# EAGLE design power_supply (EAGLE 9.6.1)
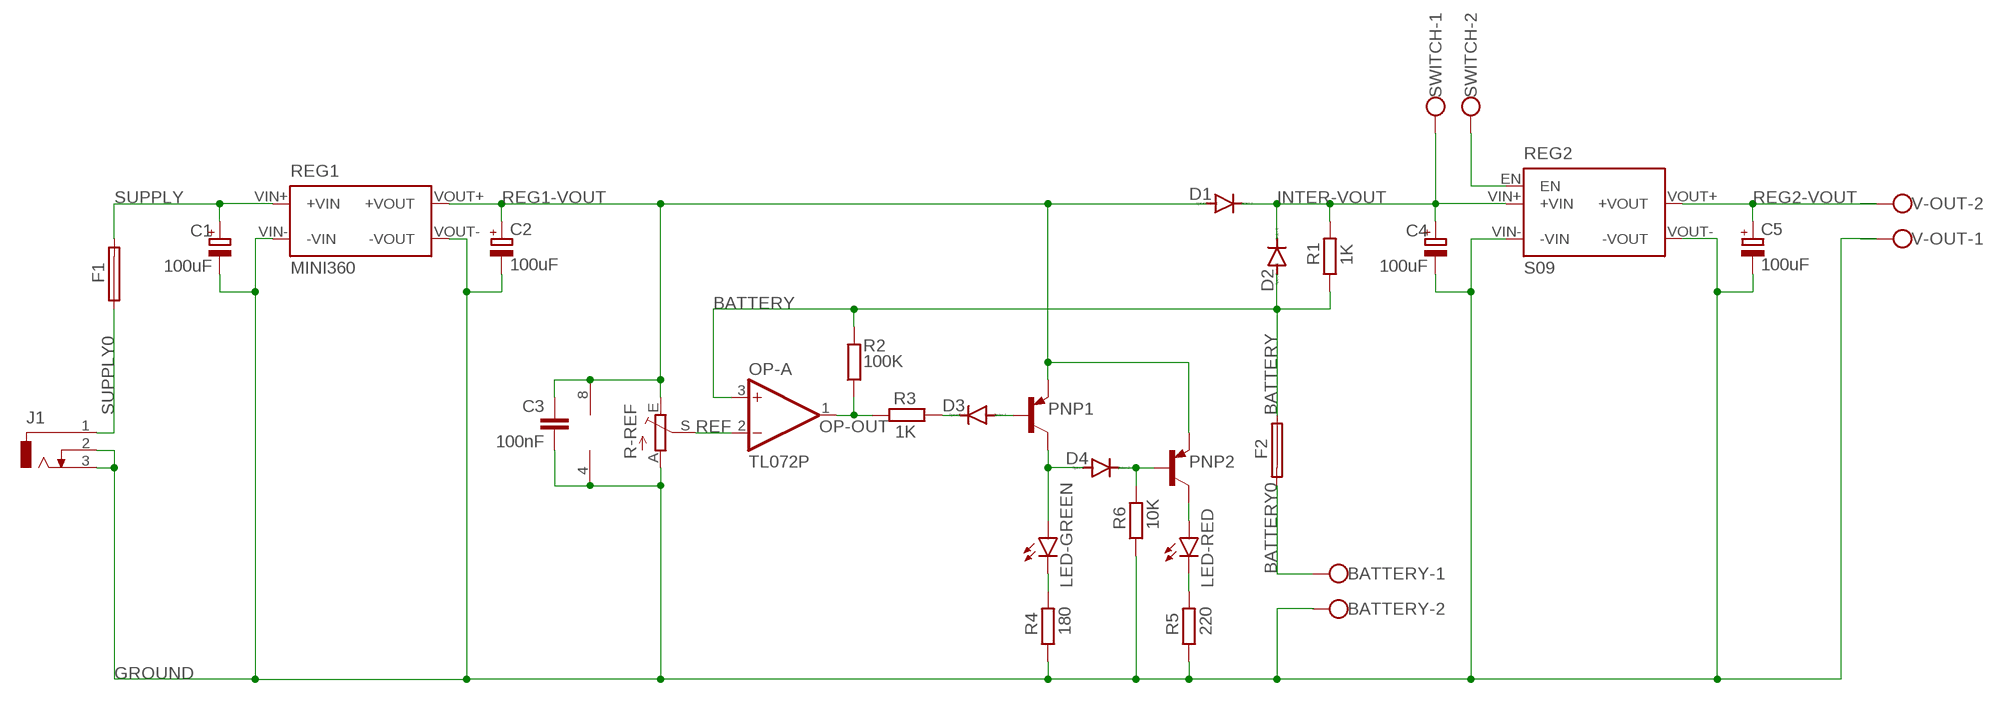
[diagram p0: schematic, sheet 1]

## Parts
BATTERY  W237-102  [W237-102]
C1  100uF  CPOL-EUE5-6  [E5-6]
C2  100uF  CPOL-EUE5-6  [E5-6]
C3  100nF  C5/2.5  [C5B2.5]
C4  100uF  CPOL-EUE2-5  [E2-5]
C5  100uF  CPOL-EUE2-5  [E2-5]
D1  BAS15  [DO34-7]
D2  BAS15  [DO34-7]
D3  BAS15  [DO34-7]
D4  BAS15  [DO34-7]
F1  SH22,5  [SH22,5]
F2  SH22,5  [SH22,5]
J1  DCJ0303  [DCJ0303]
LED-GREEN  LED5MM  [LED5MM]
LED-RED  LED5MM  [LED5MM]
OP-  TL072P  [DIL08]
PNP1  BC557A-PNP-TO92-EBC  [TO92-EBC]
PNP2  BC557A-PNP-TO92-EBC  [TO92-EBC]
R1  1K  R-EU_0204/7  [0204/7]
R2  100K  R-EU_0204/7  [0204/7]
R3  1K  R-EU_0204/7  [0204/7]
R4  180  R-EU_0204/7  [0204/7]
R5  220  R-EU_0204/7  [0204/7]
R6  10K  R-EU_0204/7  [0204/7]
R-REF  TRIM_EU-PT10  [PT-10]
REG1  MINI360  [DC-DC-CONVERTER-MINI360]
REG2  S09  [DC-DC-CONVERTER-S09]
SWITCH  W237-102  [W237-102]
V-OUT  W237-102  [W237-102]

## Nets
BATTERY: D2.A F2.1 OP-.3(A:+IN) R1.1 R2.2
BATTERY0: BATTERY.1 F2.2
ENABLE: REG2.EN SWITCH.2
GROUND: BATTERY.2 C1.- C2.- C3.2 C4.- C5.- J1.2 J1.3 OP-.4(P:V-) R4.1 R5.1 R6.1 R-REF.A REG1.VIN-(-VIN) REG1.VOUT-(-VOUT) REG2.VIN-(-VIN) REG2.VOUT-(-VOUT) V-OUT.1
INTER-VOUT: C4.+ D1.C D2.C R1.2 REG2.VIN+(+VIN) SWITCH.1
N$20: LED-RED.A PNP2.C
N$174: D3.C R3.1
N$175: D3.A PNP1.B
N$176: D4.A LED-GREEN.A PNP1.C
N$177: D4.C PNP2.B R6.2
N$179: LED-RED.K(C) R5.2
N$180: LED-GREEN.K(C) R4.2
OP-OUT: OP-.1(A:OUT) R2.1 R3.2
REF: OP-.2(A:-IN) R-REF.S
REG1-VOUT: C2.+ C3.1 D1.A OP-.8(P:V+) PNP1.E PNP2.E R-REF.E REG1.VOUT+(+VOUT)
REG2-VOUT: C5.+ REG2.VOUT+(+VOUT) V-OUT.2
SUPPLY: C1.+ F1.2 REG1.VIN+(+VIN)
SUPPLY0: F1.1 J1.1
Unconnected: OP-.5(B:+IN) OP-.6(B:-IN) OP-.7(B:OUT)

## Library data of the parts
BATTERY SWITCH V-OUT = con-wago-500:W237-102: WAGO SCREW CLAMP; MPN: 237-102; OC_FARNELL: unknown; OC_NEWARK: 70K9898
C1 C2 C4 C5 = rcl:CPOL-EU: POLARIZED CAPACITOR, European symbol; SPICEPREFIX: C
C3 = capacitor-wima:C: CAPACITOR naming: grid - package width
D1-D4 = diode:BAS15: DIODE high speed
F1 F2 = fuse:SH22,5: FUSE HOLDER grid 22,5 mm, OGN0031 8201, Schurter (Buerklin); MF: SCHURTER; MPN: 0031.8201; OC_FARNELL: 1162740; OC_NEWARK: 96F8317
J1 = con-jack:DCJ0303: DC POWER JACK Source: DCJ0303.pdf; OC_FARNELL: unknown; OC_NEWARK: unknown
LED-GREEN LED-RED = led:LED: LED OSRAM: - CHIPLED LG R971, LG N971, LY N971, LG Q971, LY Q971, LO R971, LY R971 LH N974, LH R974 LS Q976, LO Q976, LY Q976 LO Q996 - Hyper CHIPLED LW Q18S LB Q993, LB Q99A, LB R99A - SideLED LS A670, LO A670, LY A670, LG A670, LP A670 LB A673, LV A673, LT A673, LW A673 LH A674 LY A675 LS A676, LA A676, LO A676, LY A676, LW A676 LS A679, LY A679, LG A679 - Hyper Micro SIDELED® LS Y876, LA Y876, LO Y876, LY Y876 LT Y87S - SmartLED LW L88C, LW L88S LB L89C, LB L89S, LG L890 LS L89K, LO L89K, LY L89K LS L896, LA L896, LO L896, LY L896 - TOPLED LS T670, LO T670, LY T670, LG T670, LP T670 LSG T670, LSP T670, LSY T670, LOP T670, LYG T670 LG T671, LOG T671, LSG T671 LB T673, LV T673, LT T673, LW T673 LH T674 LS T676, LA T676, LO T676, LY T676, LB T676, LH T676, LSB T676, LW T676 LB T67C, LV T67C, LT T67C, LS T67K, LO T67K, LY T67K, LW E67C LS E67B, LA E67B, LO E67B, LY E67B, LB E67C, LV E67C, LT E67C LW T67C LS T679, LY T679, LG T679 LS T770, LO T770, LY T770, LG T770, LP T770 LB T773, LV T773, LT T773, LW T773 LH T774 LS E675, LA E675, LY E675, LS T675 LS T776, LA T776, LO T776, LY T776, LB T776 LHGB T686 LT T68C, LB T68C - Hyper Mini TOPLED® LB M676 - Mini TOPLED Santana® LG M470 LS M47K, LO M47K, LY M47K Source: http://www.osram.convergy.de LUXEON: - LUMILED® LXK2-PW12-R00, LXK2-PW12-S00, LXK2-PW14-U00, LXK2-PW14-V00 LXK2-PM12-R00, LXK2-PM12-S00, LXK2-PM14-U00 LXK2-PE12-Q00, LXK2-PE12-R00, LXK2-PE12-S00, LXK2-PE14-T00, LXK2-PE14-U00 LXK2-PB12-K00, LXK2-PB12-L00, LXK2-PB12-M00, LXK2-PB14-N00, LXK2-PB14-P00, LXK2-PB14-Q00 LXK2-PR12-L00, LXK2-PR12-M00, LXK2-PR14-Q00, LXK2-PR14-R00 LXK2-PD12-Q00, LXK2-PD12-R00, LXK2-PD12-S00 LXK2-PH12-R00, LXK2-PH12-S00 LXK2-PL12-P00, LXK2-PL12-Q00, LXK2-PL12-R00 Source: www.luxeon.com KINGBRIGHT: KA-3528ASYC Source: www.kingbright.com
OP- = linear:TL072: OP AMP
PNP1 PNP2 = transistor:*-PNP-: PNP Transistror
R1-R6 = rcl:R-EU_: RESISTOR, European symbol; SPICEPREFIX: R
R-REF = pot:TRIM_EU-: POTENTIOMETER
REG1 = mini360:MINI360
REG2 = s09:S09

## Board
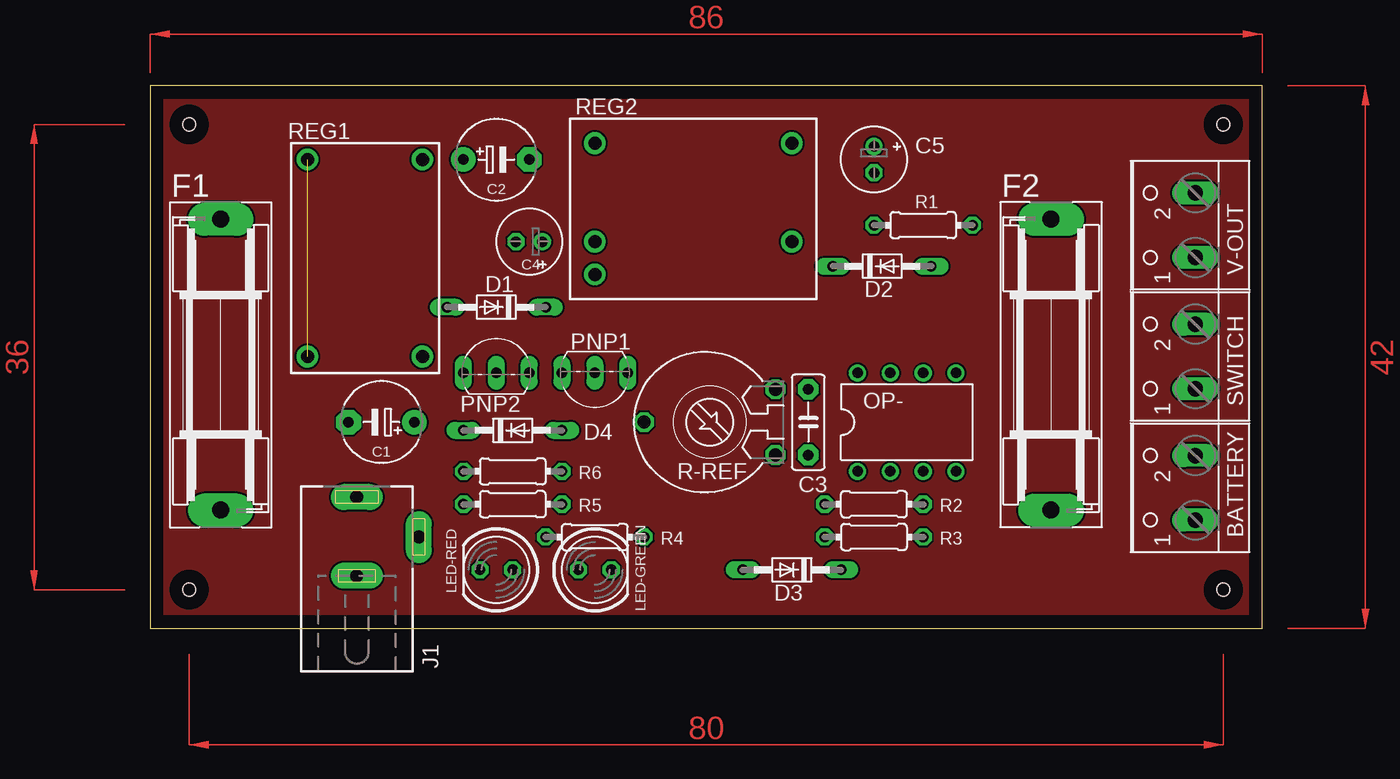
[diagram p1: board, top side]
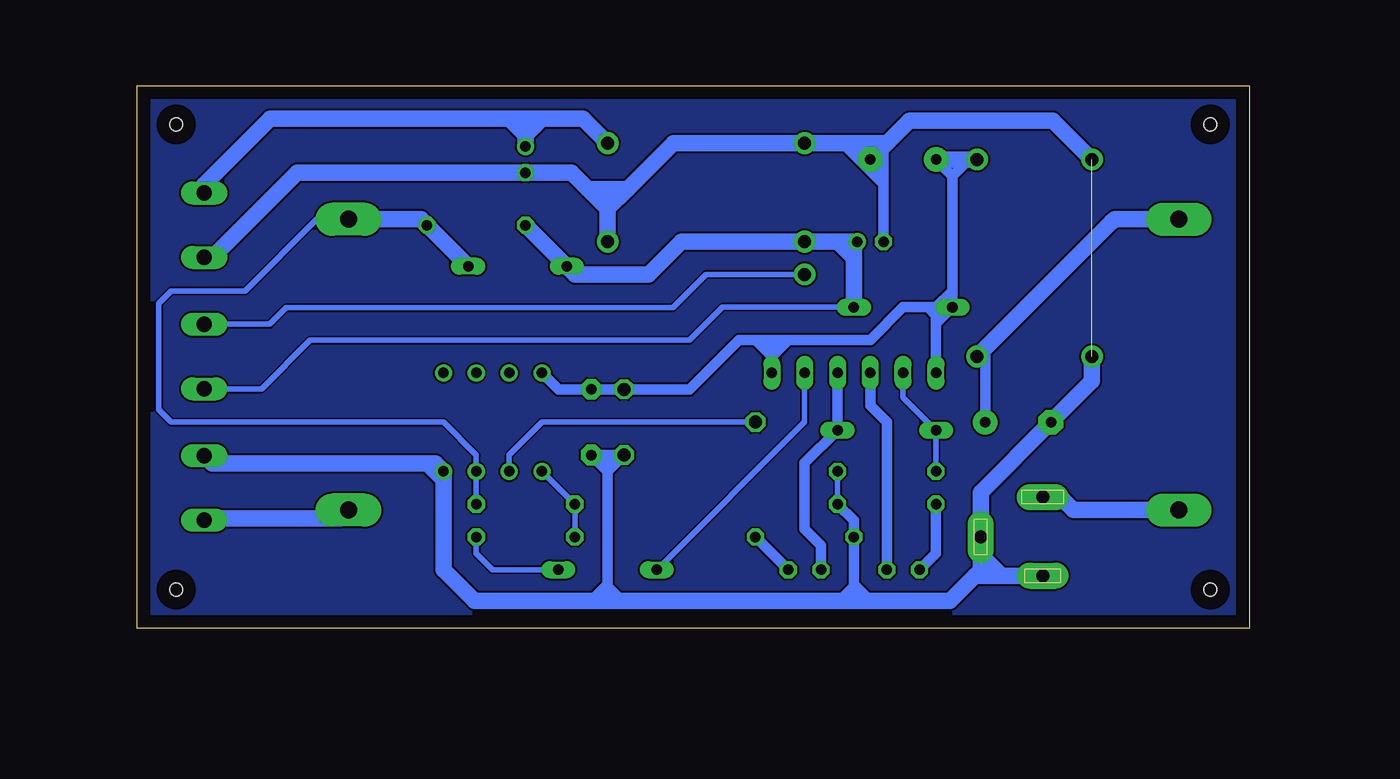
[diagram p2: board, bottom side, seen from below]

Size 86 x 42 mm. Coordinates in mm from the lower left corner, seen from the top.
Outline: 0,0 86,0 86,42 0,42 0,0
Copper layers (1*16): Top 0.035mm / dielectric 0.15mm / Bottom 0.035mm
Design rules "default": minimum track width 6mil, minimum drill 0.35mm, track to track 6mil, track to pad 6mil, pad to pad 6mil, via to via 6mil, smd to smd 6mil, copper to edge 40mil, drill to drill 6mil, minimum pad ring 10mil, minimum via ring 8mil, stop-mask expansion 4mil, vias tented up to drill 0mil, thermal gap 10mil
Holes 1 mm at 3,39 3,3 83,39 83,3

### Footprints (pad centres in the part's own frame; a part is rotated, then mirrored left to right if it is on the bottom)
W237-102 = drill 1.194 long: 1 -2.5,-1.27; 2 2.5,-1.27
E5-6 = drill 0.813 pad 1.905: + -2.54,0 | drill 0.813 pad 1.905 octagon: - 2.54,0
C5B2.5 = drill 0.813 pad 1.6 octagon: 1 -2.54,0; 2 2.54,0
E2-5 = drill 0.813 pad 1.27: + -1.016,0 | drill 0.813 pad 1.27 octagon: - 1.016,0
DO34-7 = drill 0.813 long: A 3.81,0; C -3.81,0
SH22,5 = drill 1.321 pad 2.54 long: 1 -11.252,0; 2 11.252,0
DCJ0303 = drill 1 pad 2 long: 1 0,3.1; 2 4.8,0; 3 0,-3
LED5MM = drill 0.813 octagon: A -1.27,0; K 1.27,0
DIL08 = drill 0.813 pad 1.27: 1 -3.81,-3.81; 2 -1.27,-3.81; 3 1.27,-3.81; 4 3.81,-3.81; 5 3.81,3.81; 6 1.27,3.81; 7 -1.27,3.81; 8 -3.81,3.81
TO92-EBC = drill 0.813 long: B 0,-1.27; C 2.54,-1.27; E -2.54,-1.27
0204/7 = drill 0.813 octagon: 1 -3.81,0; 2 3.81,0
PT-10 = drill 1.016 octagon: A -2.54,-5.08; E 2.54,-5.08; S 0,5.08
DC-DC-CONVERTER-MINI360 = drill 1 pad 1.676: VIN+ -7.62,-5.08; VIN- -7.62,3.81; VOUT+ 7.62,-5.08; VOUT- 7.62,3.81
DC-DC-CONVERTER-S09 = drill 1 pad 1.676: EN -7.62,-5.08; VIN+ -7.62,-2.54; VIN- -7.62,5.08; VOUT+ 7.62,5.08; VOUT- 7.62,-2.54

### Placement (x,y rotation side)
BATTERY  79.56,10.89 90 top
C1  17.88,15.96 180 top
C2  26.77,36.28 0 top
C3  50.9,15.96 270 top
C4  29.3,29.94 180 top
C5  55.98,36.28 270 top
D1  26.77,24.86 180 top
D2  56.61,28.03 0 top
D3  49.62,4.53 180 top
D4  28.04,15.33 0 top
F1  5.45,20.41 90 top
F2  69.67,20.41 270 top
J1  15.97,7.08 0 top
LED-GREEN  34.38,4.53 0 top
LED-RED  26.77,4.53 180 top
OP-  58.52,15.96 0 top
PNP1  34.38,18.5 180 top
PNP2  26.77,21.05 0 top
R1  59.78,31.2 180 top
R2  55.98,9.62 0 top
R3  55.98,7.08 180 top
R4  34.38,7.08 0 top
R5  28.04,9.62 180 top
R6  28.04,12.16 180 top
R-REF  43.27,15.96 90 top
REG1  15.97,28.66 90 top
REG2  42.01,32.48 0 top
SWITCH  79.56,21.05 90 top
V-OUT  79.56,31.2 90 top

### Tracks (layer width: path | path; a pad name or v marks a point on that pad's centre or on a via)
BATTERY
  Bottom 0.406: R2.2 OP-.3 59.78,13.43 62.33,15.96 83.38,15.96 84.37,16.96 84.37,25.13 83.38,26.12 77.66,26.12 72.12,31.66 F2.1
  Bottom 1.27: F2.1 64.05,31.66 R1.1 D2.A
BATTERY0
  Bottom 1.27: F2.2 70.31,8.52 80.7,8.52 BATTERY.1
ENABLE
  Bottom 0.406: REG2.EN 42.01,27.39 44.59,24.82 74.48,24.82 75.75,23.55 SWITCH.2
GROUND  (1 unrouted)
  Bottom 0.406: R6.1 R5.1 | R4.1 30.57,8.34
  Bottom 0.813: R5.1 30.57,8.34 30.57,3.27 | 30.57,3.27 30.57,1.99 | BATTERY.2 80.88,13.39 80.83,13.43 | 49.62,12.16 R-REF.A 49.53,13.43 | 49.62,12.16 49.62,11.52 | 49.62,11.52 49.62,8.98 49.62,3.27 | 49.62,1.99 49.62,3.27 | 29.3,2.15 30.42,3.27 30.57,3.27 | 30.57,3.27 31.69,2.15 31.84,2.15 | 49.62,3.27 48.51,2.15 47.72,2.15 | 49.62,3.27 49.78,3.27 50.9,2.15 | 49.62,12.16 C3.2 49.53,13.43 | C4.- 28.29,34.38 | 28.29,35.65 28.29,34.38 | 28.29,34.38 31.21,37.3 31.21,37.55 | C2.- 28.67,35.65 28.29,35.65 | 28.04,37.55 28.29,37.3 28.29,35.65 | 49.62,11.52 49.62,13.33 49.53,13.43
  Bottom 1.27: V-OUT.1 80.2,28.7 73.64,35.27 C5.- 52.42,35.27 51.15,34 | REG1.VIN- 12.16,19.14 C1.- 20.77,10.53 J1.2 20.77,5.7 | 62.33,11.48 62.33,4.53 59.94,2.15 50.9,2.15 47.72,2.15 31.84,2.15 29.3,2.15 23.16,2.15 21.23,4.08 | 62.33,11.48 OP-.4 62.92,12.75 63.59,12.75 | BATTERY.2 80.2,12.75 63.59,12.75 | REG2.VOUT- 49.62,32.48 | 49.62,32.48 49.62,34 | 63.59,12.75 62.33,11.48 | 20.77,5.7 20.77,4.53 | 20.77,4.53 20.31,4.08 | J1.3 19.14,4.08 | 19.14,4.08 20.31,4.08 | 20.77,4.53 21.23,4.08 | 20.31,4.08 21.23,4.08 | 19.14,4.08 20.77,5.7 | 49.62,34 48.1,34 | 48.1,34 44.55,37.55 REG2.VIN- 31.21,37.55 30.57,37.55 | 51.15,34 49.62,34 | 49.62,32.48 51.15,34 | 48.1,34 49.62,32.48 | REG1.VOUT- 15.17,39.3 26.29,39.3 28.04,37.55 | 28.04,37.55 C2.- 30.57,37.55 | 28.04,37.55 30.57,37.55
INTER-VOUT
  Bottom 0.406: SWITCH.1 76.39,18.55 72.62,22.32 43.27,22.32 40.73,24.86 D1.C
  Bottom 1.27: 31.84,29.94 REG2.VIN+ 43.91,29.94 46.45,27.39 52.16,27.39 D2.C R1.2 | 31.84,29.94 C4.+ 30.57,29.68 30.57,28.66 | 30.57,28.66 D1.C | 30.57,28.66 31.84,29.94
N$1
  pour Bottom: 0,42 86,42 86,0 0,0
N$2
  pour Top: 0,42 86,42 86,0 0,0
N$20
  Bottom 0.813: PNP2.C 29.3,17.23 28.04,15.96 LED-RED.A
N$174
  Bottom 0.406: R3.1 59.78,5.8 58.52,4.53 D3.C
N$175
  Bottom 0.406: PNP1.B 34.38,15.96 D3.A
N$176
  Bottom 0.813: LED-GREEN.A 33.12,6.44 34.38,7.71 34.38,12.79 D4.A PNP1.C
N$177
  Bottom 0.406: PNP2.B 26.77,17.87 D4.C R6.2
N$179
  Bottom 0.813: LED-RED.K 24.23,5.8 R5.2
N$180
  Bottom 0.813: R4.2 LED-GREEN.K
OP-OUT
  Bottom 0.406: R3.2 R2.1 OP-.1
REF
  Bottom 0.406: R-REF.S 54.7,15.96 57.24,13.43 OP-.2
REG1-VOUT
  Bottom 0.813: 36.92,22.32 36.92,21.05 | D1.A 24.23,24.86 | 36.92,22.32 35.66,22.32 | 35.66,22.32 29.3,22.32 26.77,24.86 24.86,24.86 | 36.92,22.32 38.2,22.32 | 38.2,22.32 39.47,22.32 43.27,18.5 R-REF.E C3.1 53.44,18.5 OP-.8 | PNP2.E 24.23,23.59 | 24.23,24.22 24.23,24.86 | 35.66,22.32 36.92,21.05 | PNP1.E 36.92,21.05 | 36.92,21.05 38.2,22.32 | D1.A 22.95,26.12 | 22.95,26.12 22.95,35.02 | 22.95,35.02 C2.+ | 21.68,36.28 22.95,35.02 | 22.95,26.12 24.23,24.86 | 24.23,24.86 24.86,24.86 | 24.23,23.59 24.23,24.22 | 24.23,24.22 24.86,24.86 | D1.A 24.23,23.59
  Bottom 1.27: REG1.VOUT+ 21.68,36.28 C2.+
REG2-VOUT
  Bottom 1.27: V-OUT.2 80.83,34.34 75.72,39.46 57.24,39.46 | 57.24,39.46 55.98,39.46 | 55.98,39.46 54.7,39.46 | 54.7,39.46 51.53,39.46 REG2.VOUT+ | C5.+ 55.98,38.19 | 55.98,39.46 55.98,38.19 | 55.98,38.19 57.24,39.46 | 55.98,38.19 54.7,39.46
SUPPLY
  Bottom 0.813: C1.+ 20.41,20.41 | 20.41,20.41 20.41,21.05 20.73,21.36 | REG1.VIN+ 20.41,20.41
  Bottom 1.27: F1.2 10.4,31.66 10.69,31.41 20.73,21.36 REG1.VIN+
SUPPLY0
  Bottom 1.27: F1.1 13.61,9.16 14.7,10.25 15.89,10.25 J1.1
(copper drawn outside any net)
  shapes: Top area x4